# EAGLE design pcm5102_dac (EAGLE 9.6.2)
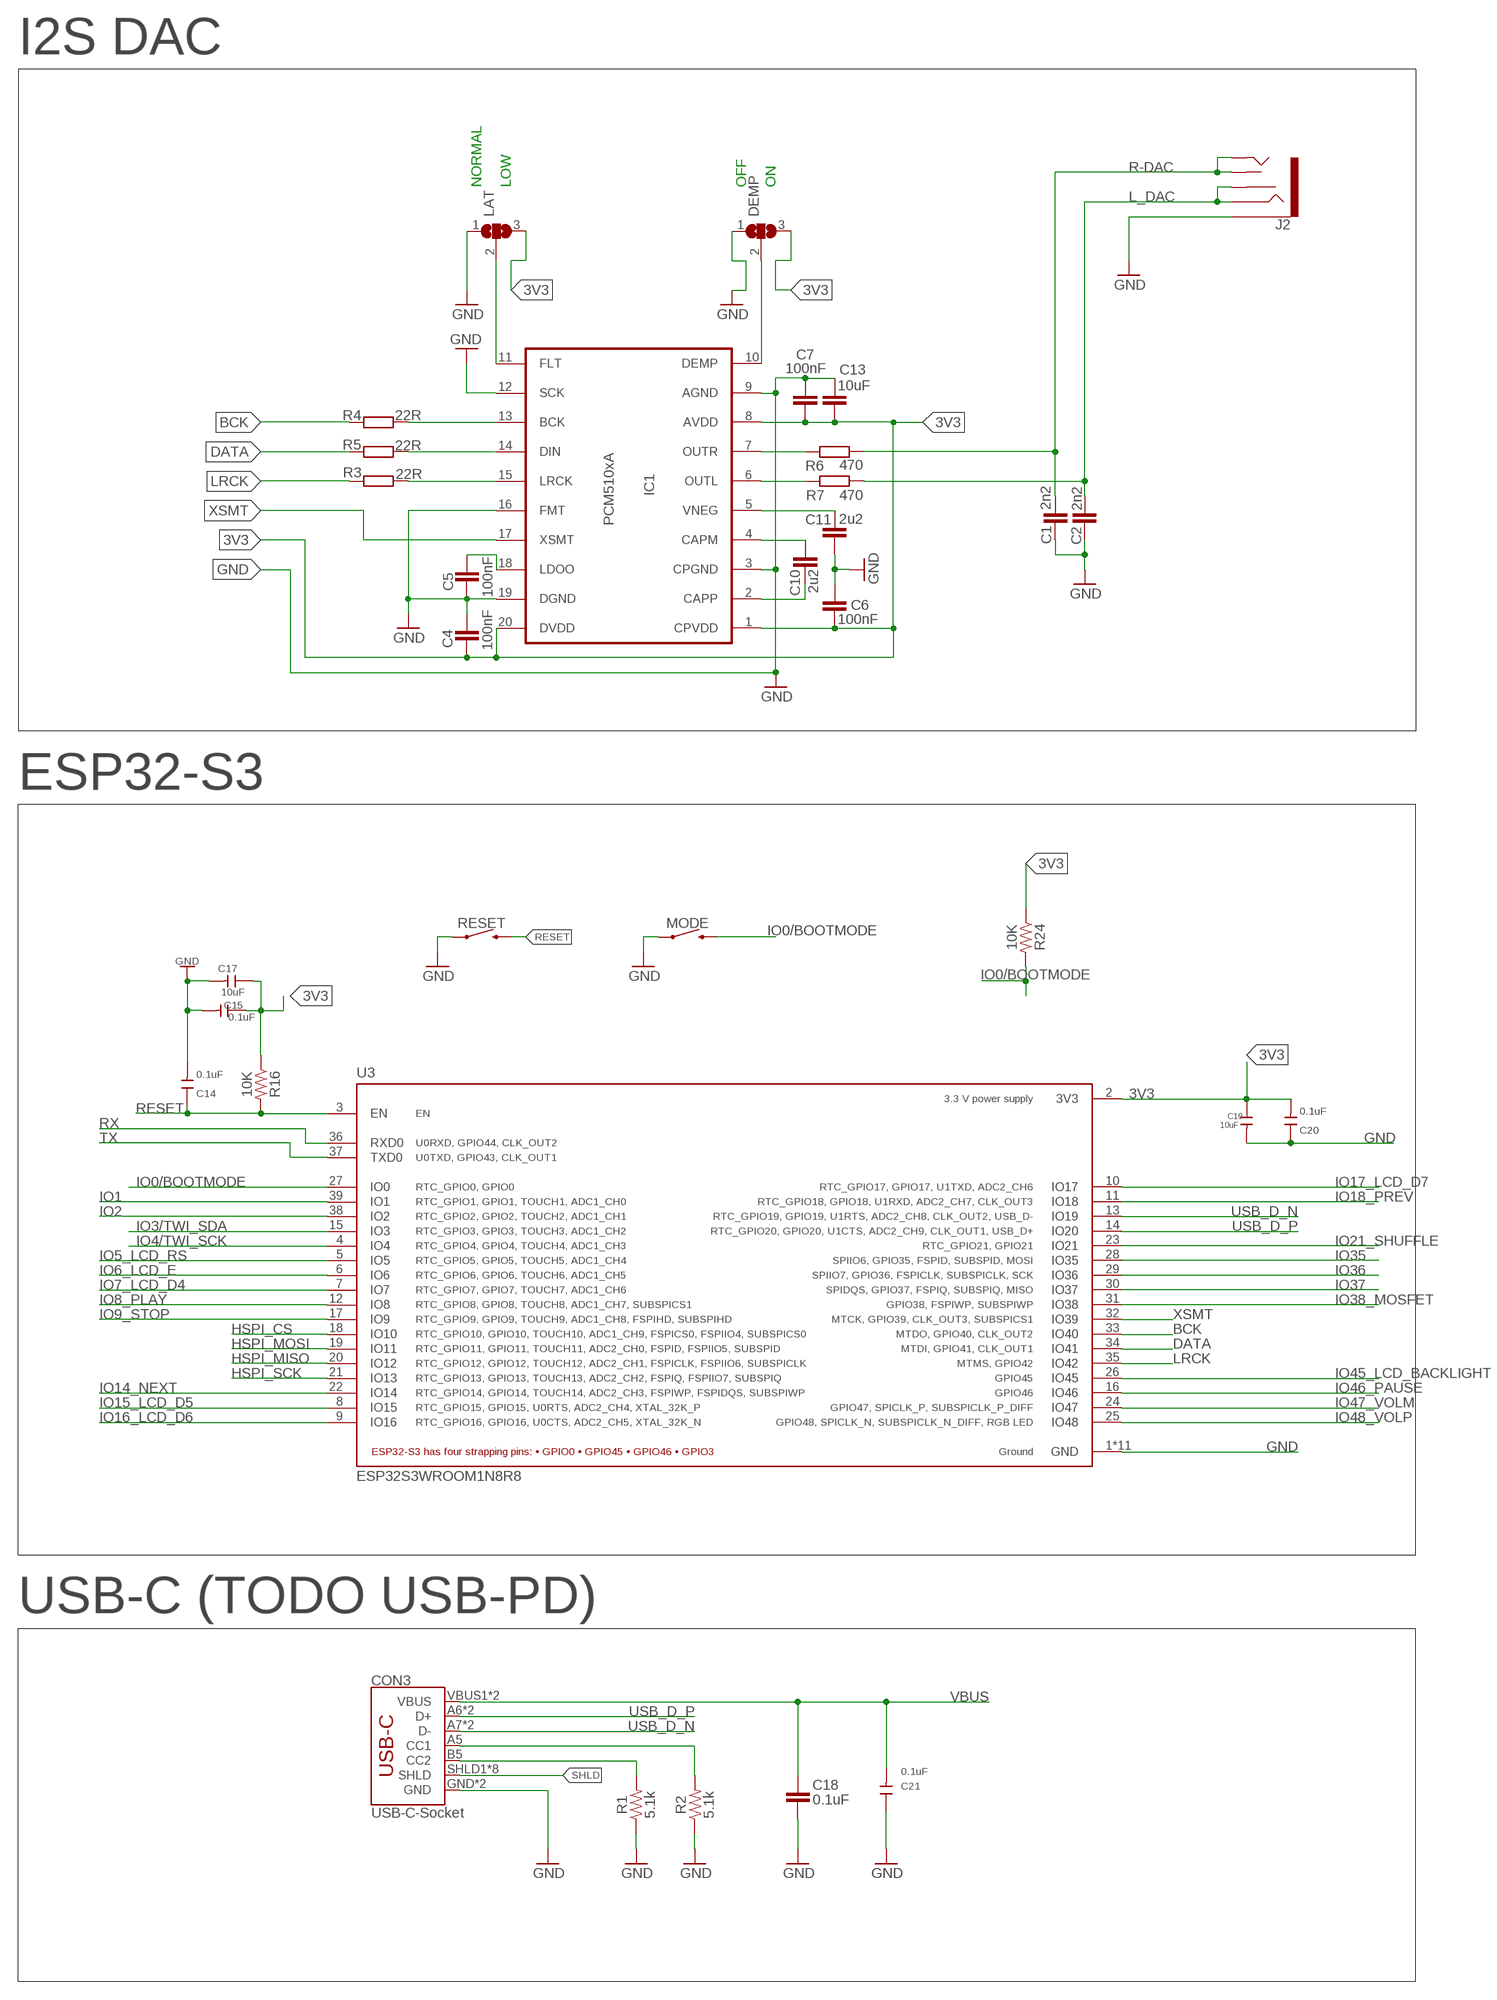
[diagram p0: schematic, sheet 1, part 1 of 3]
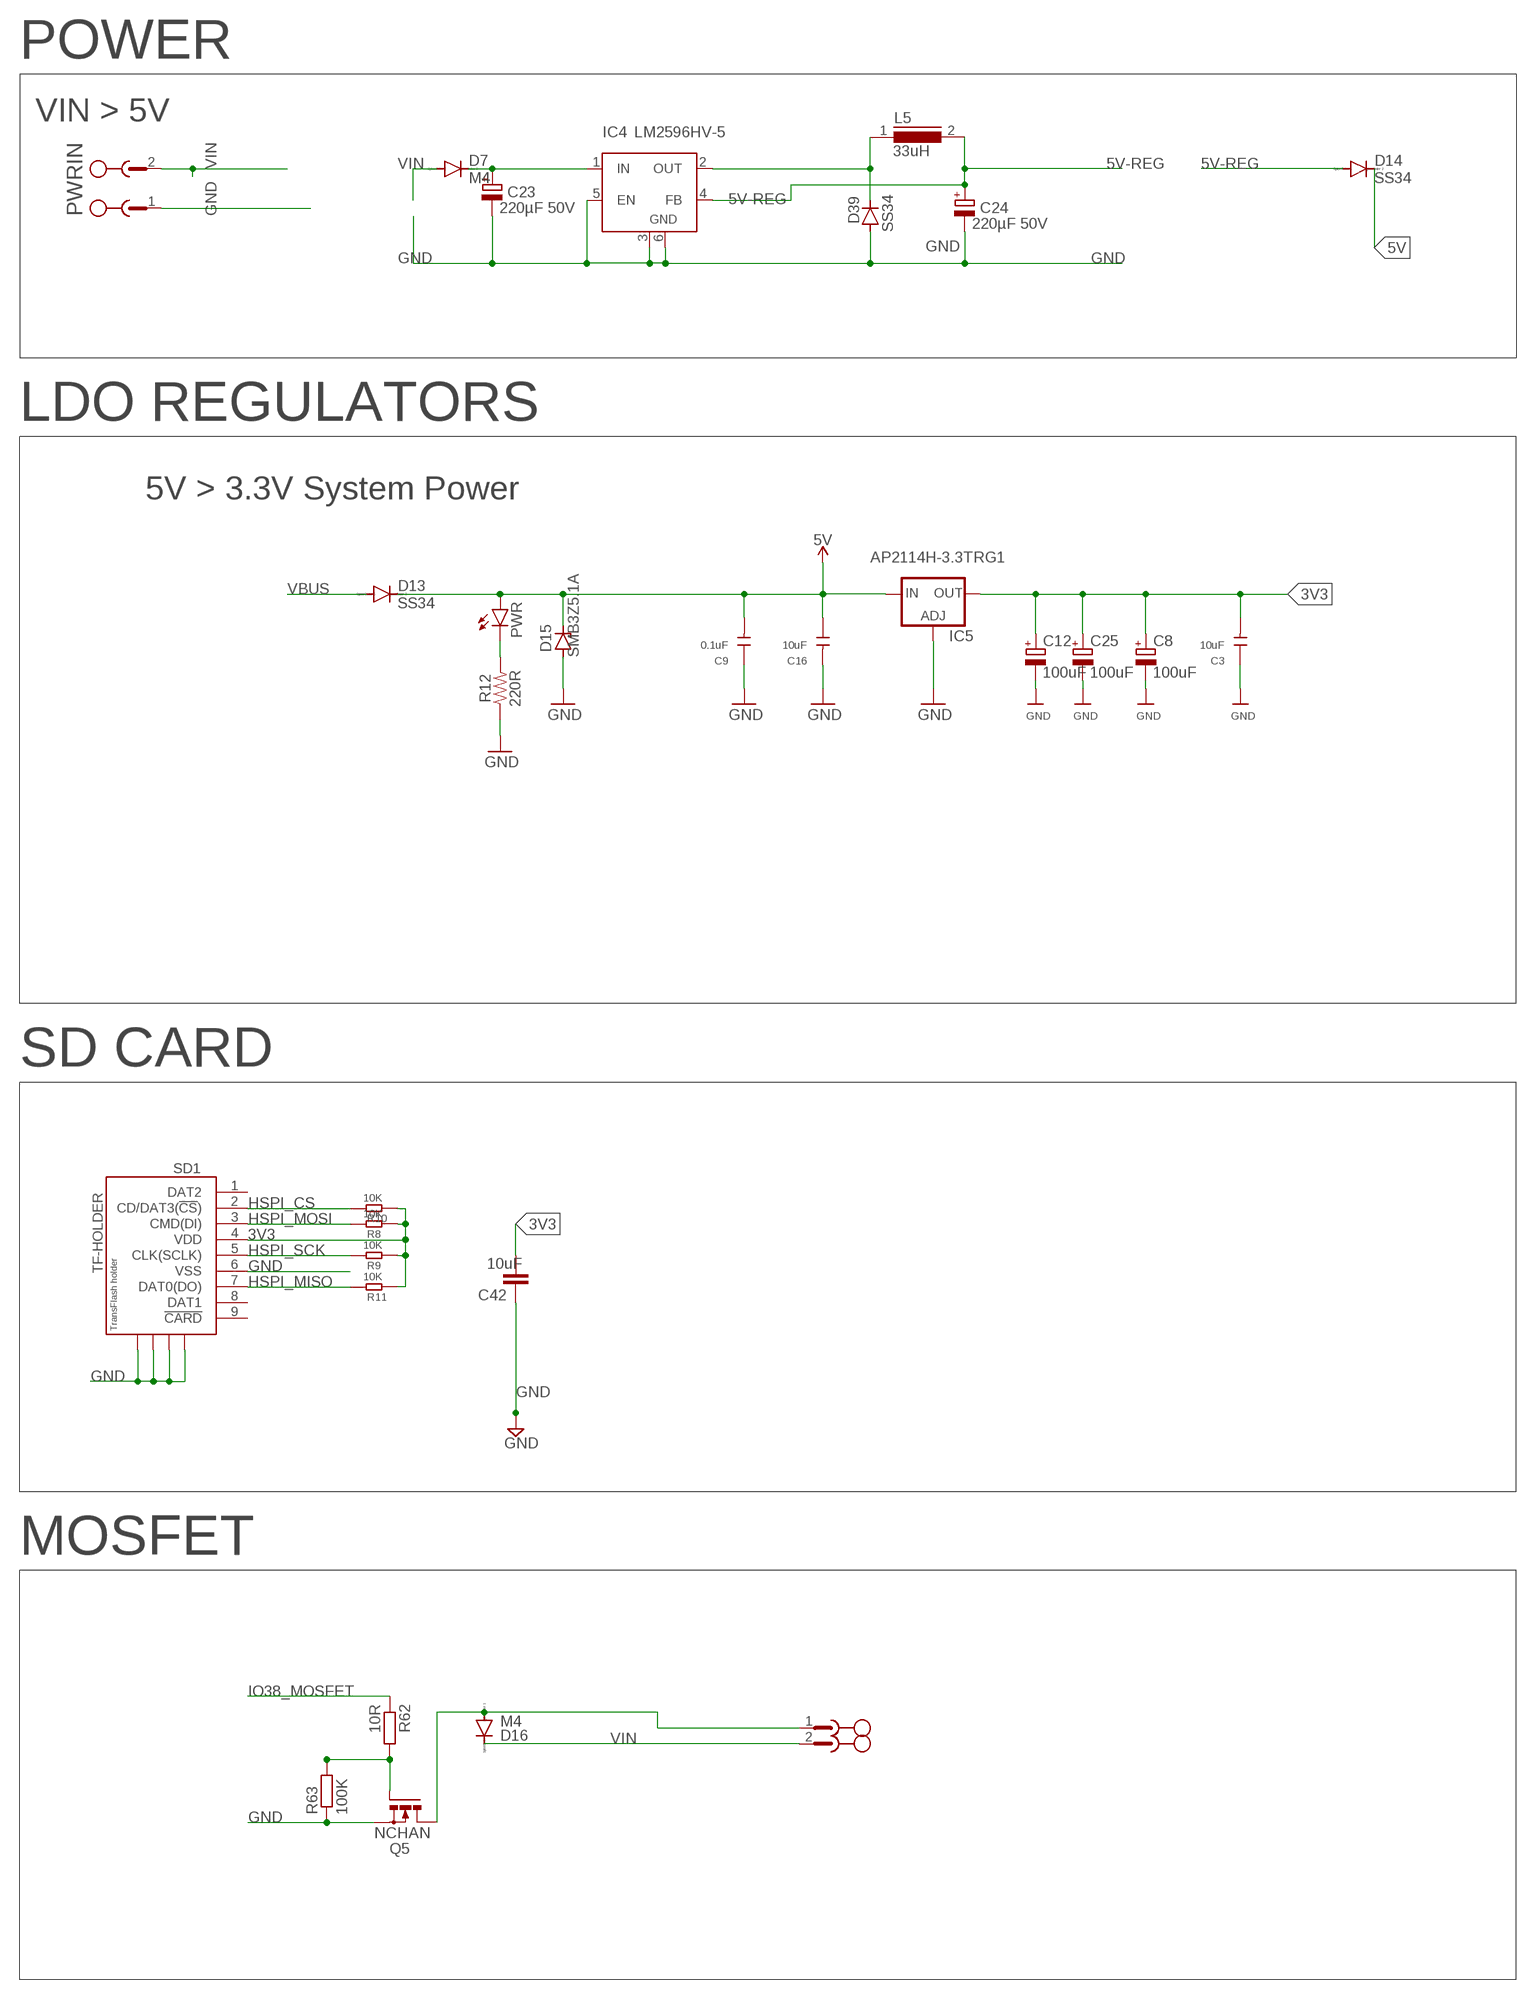
[diagram p1: schematic, sheet 1, part 2 of 3]
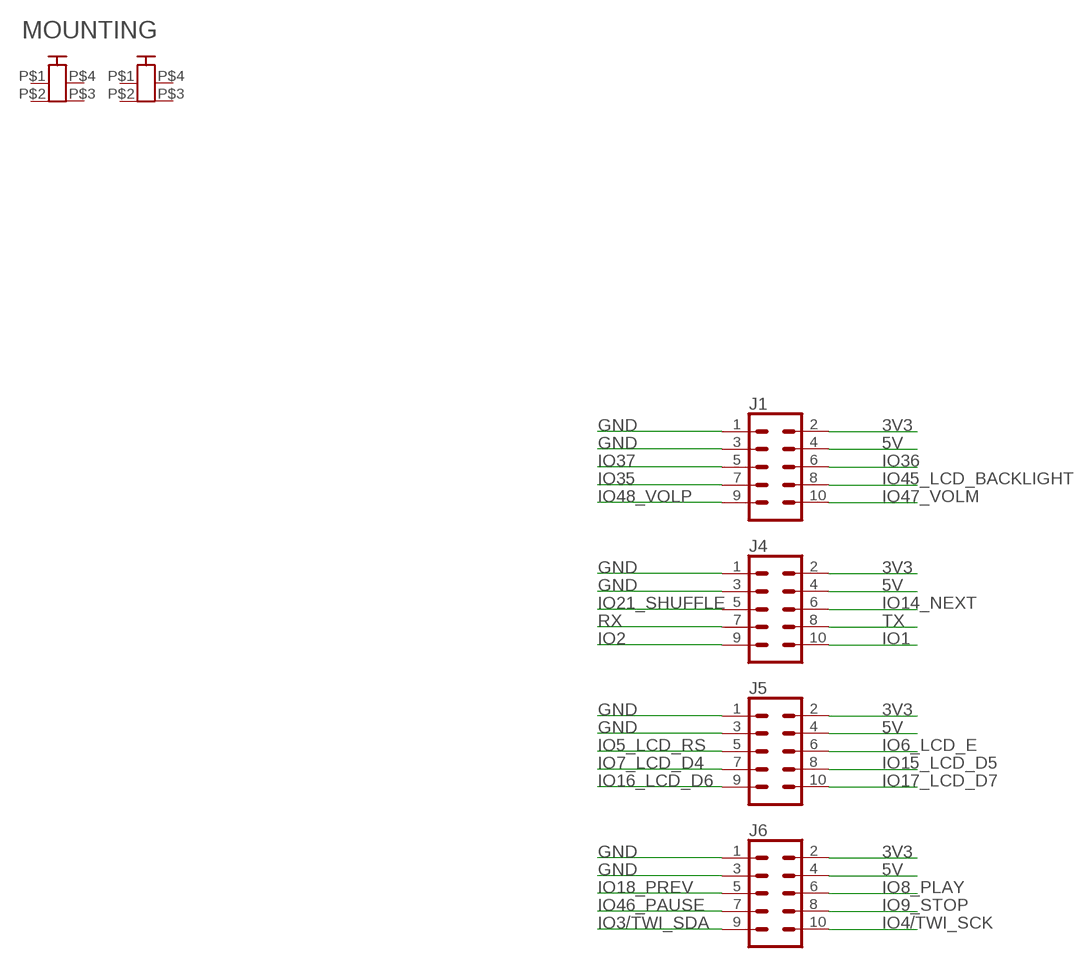
[diagram p2: schematic, sheet 1, part 3 of 3]

## Parts
C1  2n2  C-EUC1206  [C1206]
C2  2n2  C-EUC1206  [C1206]
C3  10uF  DISCRETE_C-1206  [DISCRETE_C1206]
C4  100nF  C-EUC1206  [C1206]
C5  100nF  C-EUC1206  [C1206]
C6  100nF  C-EUC1206  [C1206]
C7  100nF  C-EUC1206  [C1206]
C8  100uF  CPOL-EUD  [PANASONIC_D]
C9  0.1uF  DISCRETE_C-0603  [DISCRETE_C0603]
C10  2u2  C-EUC1206  [C1206]
C11  2u2  C-EUC1206  [C1206]
C12  100uF  CPOL-EUD  [PANASONIC_D]
C13  10uF  C-EUC1206  [C1206]
C14  0.1uF  DISCRETE_C-0603  [DISCRETE_C0603]
C15  0.1uF  DISCRETE_C-0603  [DISCRETE_C0603]
C16  10uF  C-1206  [C1206]
C17  10uF  DISCRETE_C-1206  [DISCRETE_C1206]
C18  0.1uF  CAP0603-CAP  [0603-CAP]
C19  10uF  C-1206  [C1206]
C20  0.1uF  DISCRETE_C-0603  [DISCRETE_C0603]
C21  0.1uF  DISCRETE_C-0603  [DISCRETE_C0603]
C23  220µF 50V  CPOL-EUE  [PANASONIC_E]
C24  220µF 50V  CPOL-EUE  [PANASONIC_E]
C25  100uF  CPOL-EUD  [PANASONIC_D]
C42  10uF  C-EUC1206  [C1206]
CON3  USB-C-Socket  USB_C16PIN  [USB-C-16P]
CON7  PCB-2M3  [PCB2-M3]
CON8  PCB-2M3  [PCB2-M3]
D7  M4  DIODE-DO-214AC  [DO-214AC]
D13  SS34  DIODE-DO-214AC  [DO-214AC]
D14  SS34  DIODE-DO-214AC  [DO-214AC]
D15  SMB3Z5.1A  ZENER-DIODESMB  [SMB]
D16  M4  DIODE-DO-214AC  [DO-214AC]
D39  SS34  D-SOD-87  [SOD87]
DEMP  SJ2W  [SJ_2]
IC1  PCM510xA  PCM510X  [TSSOP20]
IC4  LM2596HV-5  LM2596S  [TO263-5]
IC5  AP2114H-3.3TRG1  LD117AS33TR  [SOT223]
J1  CONN_05X2SHD  [2X5-SHROUDED]
J2  AUDIO_JACK_3.5MM_PTH  [AUDIO-JACK]
J4  CONN_05X2SHD  [2X5-SHROUDED]
J5  CONN_05X2SHD  [2X5-SHROUDED]
J6  CONN_05X2SHD  [2X5-SHROUDED]
L5  33uH  DR127  [DR127]
LAT  SJ2W  [SJ_2]
MODE  MOMENTARY-SWITCH-SPST-PTH-6.0MM  [TACTILE_SWITCH_PTH_6.0MM]
PWR  LED3MM  [LED3MM]
PWRIN  Phoenix Pluggable 5.08mm 2 way  MSTBA2  [MSTBA2]
Q5  NCHAN  N-POWER-MOSFETDPAK-MOSFET  [D-PAK_TO252AA]
R1  5.1k  5.1KOHM5.1KOHM-0603-1/10W-1%  [0603@1]
R2  5.1k  5.1KOHM5.1KOHM-0603-1/10W-1%  [0603@1]
R3  22R  R-EU_R0805  [R0805]
R4  22R  R-EU_R0805  [R0805]
R5  22R  R-EU_R0805  [R0805]
R6  470  R-EU_R1206  [R1206]
R7  470  R-EU_R1206  [R1206]
R8  10K  R-0603  [R0603]
R9  10K  R-0603  [R0603]
R10  10K  R-0603  [R0603]
R11  10K  R-0603  [R0603]
R12  220R  5.1KOHM5.1KOHM-0603-1/10W-1%  [0603@1]
R16  10K  5.1KOHM5.1KOHM-0603-1/10W-1%  [0603@1]
R24  10K  5.1KOHM5.1KOHM-0603-1/10W-1%  [0603@1]
R62  10R  R-EU_R0603  [R0603]
R63  100K  R-EU_R0603  [R0603]
RESET  MOMENTARY-SWITCH-SPST-PTH-6.0MM  [TACTILE_SWITCH_PTH_6.0MM]
SD1  TF-HOLDER  [TF-PULL]
SWOUT  Phoenix Pluggable 5.08mm 2 way  MSTBA2  [MSTBA2]
U3  ESP32S3WROOM1N8R8  [XCVR_ESP32S3WROOM1N8R8]

## Nets
3V3: C3.2 C4.2 C6.2 C7.2 C8.+ C12.+ C13.2 C15.1 C17.1 C19.1 C20.2 C25.+ C42.2 DEMP.3 IC1.1(CPVDD) IC1.8(AVDD) IC1.20(DVDD) IC5.4(OUT) J1.2 J4.2 J5.2 J6.2 LAT.3 R8.1 R9.1 R10.1 R11.1 R16.1 R24.1 SD1.4(VDD) U3.2(3V3)
5V: C9.2 C16.1 D13.C D14.C D15.C IC5.3(IN) J1.4 J4.4 J5.4 J6.4 PWR.A
5V-REG: C24.+ D14.A IC4.4(FB) L5.2
+24V: C23.+ D7.C IC4.1(IN)
BCK: R4.1 U3.33(IO40)
CC1: CON3.A5(CC1) R2.2
CC2: CON3.B5(CC2) R1.2
DATA: R5.1 U3.34(IO41)
GND: C1.2 C2.2 C3.1 C4.1 C5.2 C6.1 C7.1 C8.- C9.1 C11.2 C12.- C13.1 C14.2 C15.2 C16.2 C17.2 C18.2 C19.2 C20.1 C21.1 C23.- C24.- C25.- C42.1 CON3.GND CON3.GND2(GND) D15.A D39.2(A) DEMP.1 IC1.3(CPGND) IC1.9(AGND) IC1.12(SCK) IC1.16(FMT) IC1.19(DGND) IC4.3(GND) IC4.5(EN) IC4.6(GND) IC5.1(ADJ) J1.1 J1.3 J2.SLEEVE J4.1 J4.3 J5.1 J5.3 J6.1 J6.3 LAT.1 MODE.1 PWRIN.1 Q5.3(S) R1.1 R2.1 R12.1 R63.1 RESET.1 SD1.6(VSS) SD1.S1 SD1.S2 SD1.S3 SD1.S4 U3.1(GND) U3.40(GND) U3.41_1(GND) U3.41_2(GND) U3.41_3(GND) U3.41_4(GND) U3.41_5(GND) U3.41_6(GND) U3.41_7(GND) U3.41_8(GND) U3.41_9(GND)
HSPI_CS: R10.2 SD1.2(CD/DAT3(!CS!)) U3.18(IO10)
HSPI_MISO: R11.2 SD1.7(DAT0(DO)) U3.20(IO12)
HSPI_MOSI: R8.2 SD1.3(CMD(DI)) U3.19(IO11)
HSPI_SCK: R9.2 SD1.5(CLK(SCLK)) U3.21(IO13)
IO0/BOOTMODE: MODE.3 R24.2 U3.27(IO0)
IO1: J4.10 U3.39(IO1)
IO2: J4.9 U3.38(IO2)
IO3/TWI_SDA: J6.9 U3.15(IO3)
IO4/TWI_SCK: J6.10 U3.4(IO4)
IO5_LCD_RS: J5.5 U3.5(IO5)
IO6_LCD_E: J5.6 U3.6(IO6)
IO7_LCD_D4: J5.7 U3.7(IO7)
IO8_PLAY: J6.6 U3.12(IO8)
IO9_STOP: J6.8 U3.17(IO9)
IO14_NEXT: J4.6 U3.22(IO14)
IO15_LCD_D5: J5.8 U3.8(IO15)
IO16_LCD_D6: J5.9 U3.9(IO16)
IO17_LCD_D7: J5.10 U3.10(IO17)
IO18_PREV: J6.5 U3.11(IO18)
IO21_SHUFFLE: J4.5 U3.23(IO21)
IO35: J1.7 U3.28(IO35)
IO36: J1.6 U3.29(IO36)
IO37: J1.5 U3.30(IO37)
IO38_MOSFET: R62.1 U3.31(IO38)
IO45_LCD_BACKLIGHT: J1.8 U3.26(IO45)
IO46_PAUSE: J6.7 U3.16(IO46)
IO47_VOLM: J1.10 U3.24(IO47)
IO48_VOLP: J1.9 U3.25(IO48)
L_DAC: C2.1 J2.RING J2.RSH R7.2
LDOO: C5.1 IC1.18(LDOO)
LRCK: R3.1 U3.35(IO42)
MOSFET-GND: D16.A Q5.4(D) SWOUT.1
N$1: PWR.K(C) R12.2
N$3: Q5.1(G) R62.2 R63.2
N$10: IC1.13(BCK) R4.2
N$11: IC1.14(DIN) R5.2
N$12: IC1.11(FLT) LAT.2
N$13: DEMP.2 IC1.10(DEMP)
N$34: IC1.15(LRCK) R3.2
N$43: C10.1 IC1.4(CAPM)
N$46: C10.2 IC1.2(CAPP)
N$47: C11.1 IC1.5(VNEG)
N$48: IC1.7(OUTR) R6.1
N$49: IC1.6(OUTL) R7.1
N$164: D39.1(C) IC4.2(OUT) L5.1
R-DAC: C1.1 J2.TIP J2.TSH R6.2
RESET: C14.1 R16.2 RESET.3 U3.3(EN)
RX: J4.7 U3.36(RXD0)
SHLD: CON3.SHLD1(SHLD) CON3.SHLD2(SHLD) CON3.SHLD3(SHLD) CON3.SHLD4(SHLD) CON3.SHLD5(SHLD) CON3.SHLD6(SHLD) CON3.SHLD7(SHLD) CON3.SHLD8(SHLD)
TX: J4.8 U3.37(TXD0)
USB_D_N: CON3.A7(D-) CON3.B7(D-) U3.13(IO19)
USB_D_P: CON3.A6(D+) CON3.B6(D+) U3.14(IO20)
VBUS: C18.1 C21.2 CON3.VBUS1(VBUS) CON3.VBUS2(VBUS) D13.A
VIN: D7.A D16.C PWRIN.2 SWOUT.2
XSMT: IC1.17(XSMT) U3.32(IO39)
Unconnected: CON7.P$1 CON7.P$2 CON7.P$3 CON7.P$4 CON8.P$1 CON8.P$2 CON8.P$3 CON8.P$4 SD1.1(DAT2) SD1.8(DAT1) SD1.9(!CARD)

## Notes on the sheet
- I2S DAC
- NORMAL | LOW | OFF | ON
- ESP32-S3
- USB-C (TODO USB-PD)
- MOUNTING
- POWER
- VIN > 5V
- PWRIN
- LDO REGULATORS
- 5V > 3.3V System Power
- SD CARD
- MOSFET

## Library data of the parts
C1 C2 C4-C7 C10 C11 C13 = rcl:C-EU: CAPACITOR, European symbol
C3 C9 C14 C15 C17 C20 C21 = A9G:DISCRETE_C*: Ceramic Capacitors
C8 C12 C25 = rcl:CPOL-EU: POLARIZED CAPACITOR, European symbol; SPICEPREFIX: C
C16 C19 = discrete:C*: Ceramic Capacitors
C18 = SparkFun:CAP: Capacitor Standard 0603 ceramic capacitor, and 0.1" leaded capacitor.
C23 C24 = resistor:CPOL-EU: POLARIZED CAPACITOR, European symbol
C42 = resistor:C-EU: CAPACITOR, European symbol
CON3 = SparkFun-Connectors:USB_C: USB Type C 16Pin Connector Super Speed pins not available on the 16-pin purely SMD connector so this part is best for USB 2.0 implementations. D1 and D2 are tied together enabling D+/- no matter which way the cable is plugged into the connector. The two channel configuration pins (CC1/2) are exposed. These are normally connected to ground via 5.1k resistors but can be reconfigured for high current/high power applications.; PROD_ID: CONN-14122
CON7 CON8 = Screw Terminals:PCB-2M3
D7 D13 D14 D16 = diode:DIODE-: DIODE
D15 = diode:ZENER-DIODE: Z-Diode
D39 = semicon-smd-ipc:D-: DIODE unfilled
DEMP LAT = jumper:SJ2W: SMD solder JUMPER
IC1 = pavouk:PCM510X: 2VRMS DirectPath™, 112/106/100dB Audio Stereo DAC with 32-bit, 384kHz PCM Interface
IC4 = linear:LM2596S: STEP-DOWN VOLTAGE REGULATOR
IC5 = v-reg:LD117A?*: Low drop fixed and adjustable positive voltage regulators 1 A Source: http://www.st.com/stonline/products/literature/ds/7194/ld1117axx.pdf
J1 J4-J6 = SparkFun-Connectors:CONN_05X2: Multi connection point. Often used as Generic Header-pin footprint for 0.1 inch spaced/style header connections For AVR SPI programming port, see special device with nice symbol: "AVR_SPI_PROG_5x2.dev" You can populate with any combo of single row headers, but if you'd like an exact match, check these: 2x5 AVR ICSP Male Header <https://www.sparkfun.com/products/778> (PRT-00778) 2x5 Pin Shrouded Header <https://www.sparkfun.com/products/8506> (PRT-08506) On any of the 0.1 inch spaced packages, you can populate with these: Break Away Headers - Straight <https://www.sparkfun.com/products/116> (PRT-00116) Break Away Male Headers - Right Angle <https://www.sparkfun.com/products/553> (PRT-00553) Female Headers <https://www.sparkfun.com/products/115> (PRT-00115) Break Away Headers - Machine Pin <https://www.sparkfun.com/products/117> (PRT-00117) Break Away Female Headers - Swiss Machine Pin <https://www.sparkfun.com/products/743> (PRT-00743) Special note: the shrouded connector mates well with our 5x2 ribbon cables: 2x5 Pin IDC Ribbon Cable <https://www.sparkfun.com/products/8535> (PRT-08535); PROD_ID: CONN-08671; SF_ID: PRT-08506
J2 = SparkFun-Connectors2:AUDIO_JACK_3.5MM: Audio Jack 3.5mm variants of PTH and SMT stereo audio jack with bypass switches. SparkFun Products: SparkFun SparkPunk Sound Kit <[https://www.sparkfun.com/products/11177]> - PTH MP3 Trigger <https://www.sparkfun.com/products/13720> -3.5mm SMD SparkFun PicoBoard <https://www.sparkfun.com/products/11888>- 2.5mm SMD; PROD_ID: CONN-08774; SF_ID: PRT-08032
L5 = inductors:DR127: High Power Density, High Efficiency, Shielded Inductors Source: coiltronics_dr_series.pdf; SPICEPREFIX: L
MODE RESET = SparkFun-Switches:MOMENTARY-SWITCH-SPST: Momentary Switch (Pushbutton) - SPST Normally-open (NO) SPST momentary switches (buttons, pushbuttons). Variants PTH-12MM - 12mm square, through-hole Momentary Pushbutton Switch - 12mm Square <https://www.sparkfun.com/products/9190> (COM-09190) PTH-6.0MM, PTH-6.0MM-KIT - 6.0mm square, through-hole Mini Pushbutton Switch <https://www.sparkfun.com/products/97> (COM-00097) KIT package intended for soldering kit's - only one side of pads' copper is exposed. PTH-RIGHT-ANGLE-KIT - Right-angle, through-hole Right Angle Tactile Button <https://www.sparkfun.com/products/10791> - Used on SparkFun BigTime Watch Kit <https://www.sparkfun.com/products/11734> SMD-12MM - 12mm square, surface-mount Tactile Button - SMD (12mm) <https://www.sparkfun.com/products/12993> (COM-12993) Used on SparkFun PicoBoard <https://www.sparkfun.com/products/11888> SMD-4.5MM - 4.5mm Square Trackball Switch Used on SparkFun Blackberry Trackballer Breakout <https://www.sparkfun.com/products/13169> SMD-4.6MMX2.8MM - 4.60mm x 2.80mm, surface mount Used on SparkFun SAMD21 Mini Breakout <https://www.sparkfun.com/products/13664> SMD-5.2MM, SMD-5.2-REDUNDANT - 5.2mm square, surface-mount Mini Pushbutton Switch - SMD <https://www.sparkfun.com/products/8720> (COM-08720) Used on Arduino Pro Mini <https://www.sparkfun.com/products/11114> REDUNDANT package connects both switch circuits together SMD-6.0X3.5MM - 6.0 x 3.5mm, surface mount Momentary Reset Switch SMD <https://www.sparkfun.com/products/8229> (COM-08229) SMD-6.2MM-TALL - 6.2mm square, surface mount Tactile Button - SMD (6mm) <https://www.sparkfun.com/products/12992> Used on SparkFun Digital Sandbox <https://www.sparkfun.com/products/12651> SMD-RIGHT-ANGLE - Right-angle, surface mount Used on SparkFun Block for Intel® Edison - Arduino <https://www.sparkfun.com/products/13036>; PROD_ID: SWCH-08441; SF_SKU: COM-00097
PWR = led:LED: LED OSRAM: - CHIPLED LG R971, LG N971, LY N971, LG Q971, LY Q971, LO R971, LY R971 LH N974, LH R974 LS Q976, LO Q976, LY Q976 LO Q996 - Hyper CHIPLED LW Q18S LB Q993, LB Q99A, LB R99A - SideLED LS A670, LO A670, LY A670, LG A670, LP A670 LB A673, LV A673, LT A673, LW A673 LH A674 LY A675 LS A676, LA A676, LO A676, LY A676, LW A676 LS A679, LY A679, LG A679 - Hyper Micro SIDELED® LS Y876, LA Y876, LO Y876, LY Y876 LT Y87S - SmartLED LW L88C, LW L88S LB L89C, LB L89S, LG L890 LS L89K, LO L89K, LY L89K LS L896, LA L896, LO L896, LY L896 - TOPLED LS T670, LO T670, LY T670, LG T670, LP T670 LSG T670, LSP T670, LSY T670, LOP T670, LYG T670 LG T671, LOG T671, LSG T671 LB T673, LV T673, LT T673, LW T673 LH T674 LS T676, LA T676, LO T676, LY T676, LB T676, LH T676, LSB T676, LW T676 LB T67C, LV T67C, LT T67C, LS T67K, LO T67K, LY T67K, LW E67C LS E67B, LA E67B, LO E67B, LY E67B, LB E67C, LV E67C, LT E67C LW T67C LS T679, LY T679, LG T679 LS T770, LO T770, LY T770, LG T770, LP T770 LB T773, LV T773, LT T773, LW T773 LH T774 LS E675, LA E675, LY E675, LS T675 LS T776, LA T776, LO T776, LY T776, LB T776 LHGB T686 LT T68C, LB T68C - Hyper Mini TOPLED® LB M676 - Mini TOPLED Santana® LG M470 LS M47K, LO M47K, LY M47K Source: http://www.osram.convergy.de LUXEON: - LUMILED® LXK2-PW12-R00, LXK2-PW12-S00, LXK2-PW14-U00, LXK2-PW14-V00 LXK2-PM12-R00, LXK2-PM12-S00, LXK2-PM14-U00 LXK2-PE12-Q00, LXK2-PE12-R00, LXK2-PE12-S00, LXK2-PE14-T00, LXK2-PE14-U00 LXK2-PB12-K00, LXK2-PB12-L00, LXK2-PB12-M00, LXK2-PB14-N00, LXK2-PB14-P00, LXK2-PB14-Q00 LXK2-PR12-L00, LXK2-PR12-M00, LXK2-PR14-Q00, LXK2-PR14-R00 LXK2-PD12-Q00, LXK2-PD12-R00, LXK2-PD12-S00 LXK2-PH12-R00, LXK2-PH12-S00 LXK2-PL12-P00, LXK2-PL12-Q00, LXK2-PL12-R00 Source: www.luxeon.com KINGBRIGHT: KA-3528ASYC Source: www.kingbright.com
PWRIN SWOUT = con-phoenix-508:MSTBA2: PHOENIX; MF: FARNELL; MPN: 1757242; OC_FARNELL: 3705171; OC_NEWARK: 71C4161
Q5 = Cohesion_parts:N-POWER-MOSFET
R1 R2 = SparkFun-Resistors:5.1KOHM; PROD_ID: RES-12083
R3-R7 = rcl:R-EU_: RESISTOR, European symbol
R8-R11 = discrete:R*
R12 R16 R24 = SparkFun-Resistors:5.1KOHM; PROD_ID: RES-12083; VALUE: 5.1k
R62 R63 = resistor:R-EU_: RESISTOR, European symbol
SD1 = sd-mmc:TF-HOLDER: TF / Micro SD socket is PUSH-PUSH type, the card can be pushed into and auto locked and pushed out by simply press the card. Surface Mounting type.
U3 = ESP32S3WROOM1N8R8:ESP32S3WROOM1N8R8: Check availability <https://pricing.snapeda.com/parts/ESP32S3WROOM1N8R8/Espressif%20Systems/view-part?ref=eda>; AVAILABILITY: In Stock; DESCRIPTION: Bluetooth, WiFi 802.11b/g/n, Bluetooth v5.0 Transceiver Module 2.4GHz PCB Trace Surface Mount; MF: Espressif Systems; MP: ESP32S3WROOM1N8R8; PACKAGE: None; PRICE: None; PURCHASE-URL: https://pricing.snapeda.com/search/part/ESP32S3WROOM1N8R8/?ref=eda

## Net classes
0 default: width 0.254 mm, clearance 0.152 mm

## Board
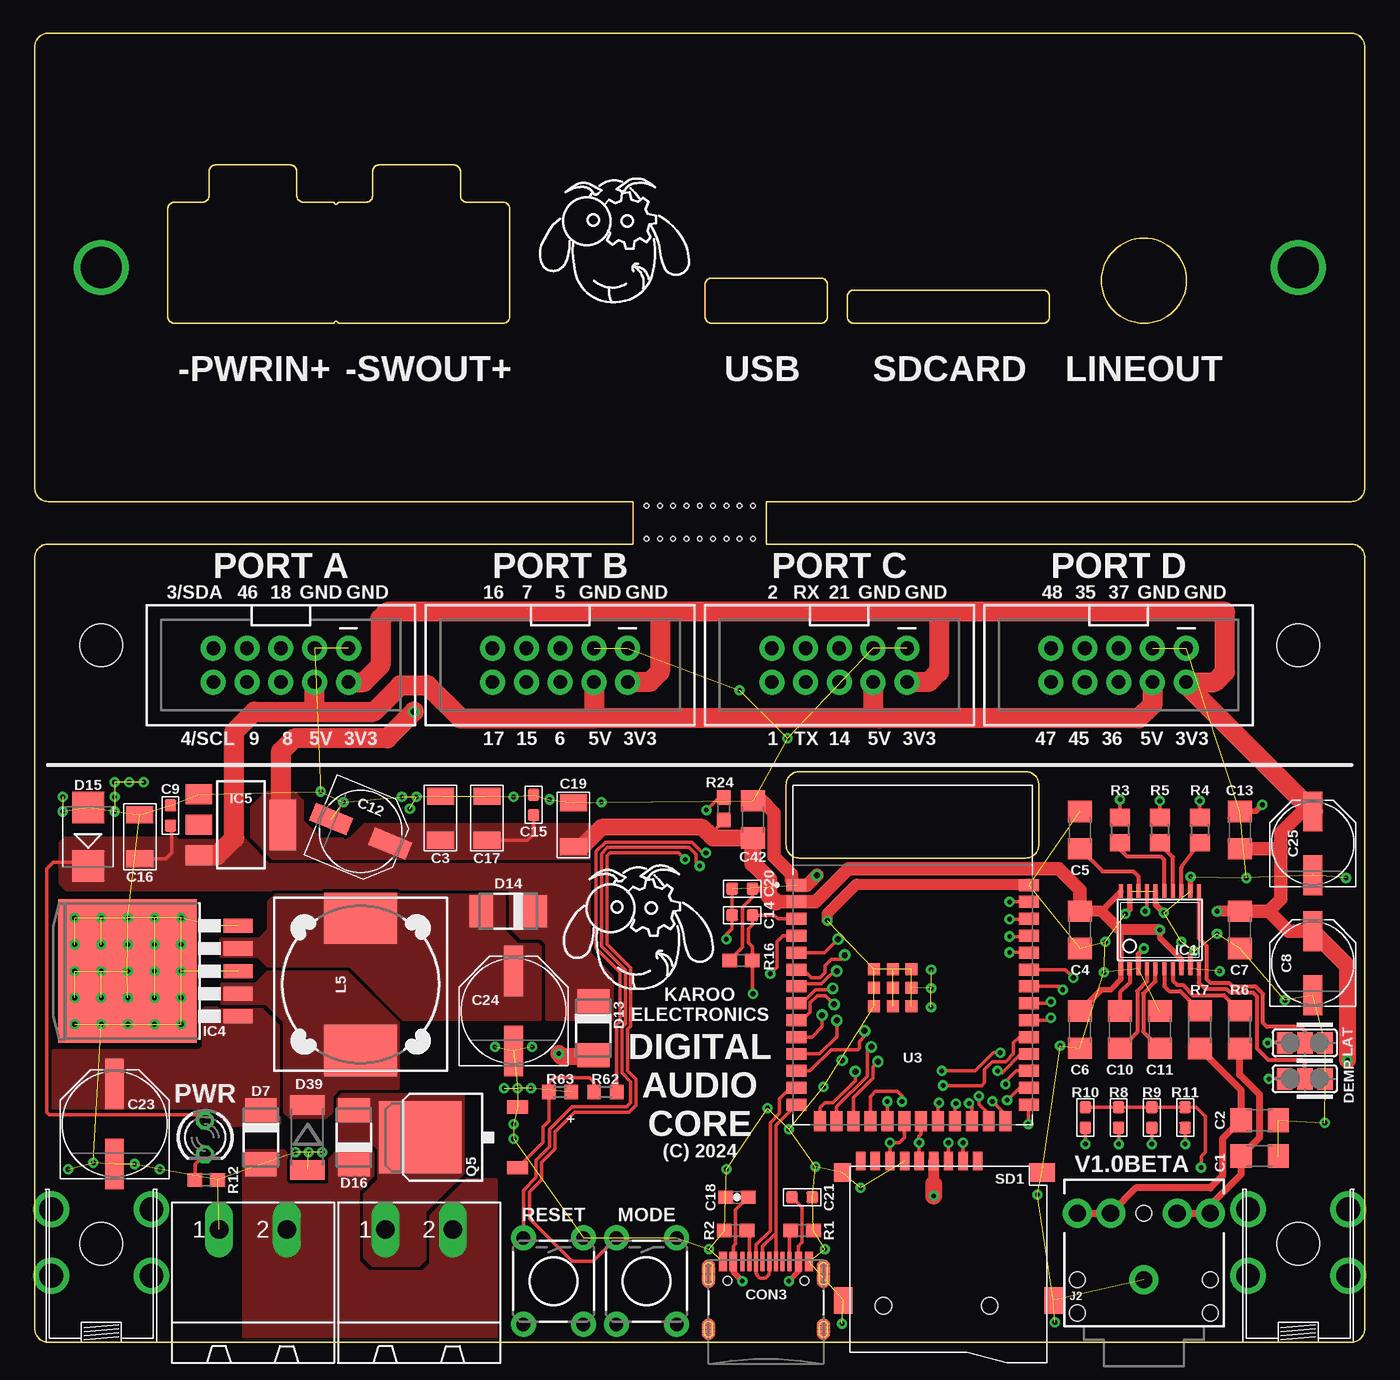
[diagram p3: board, top side]
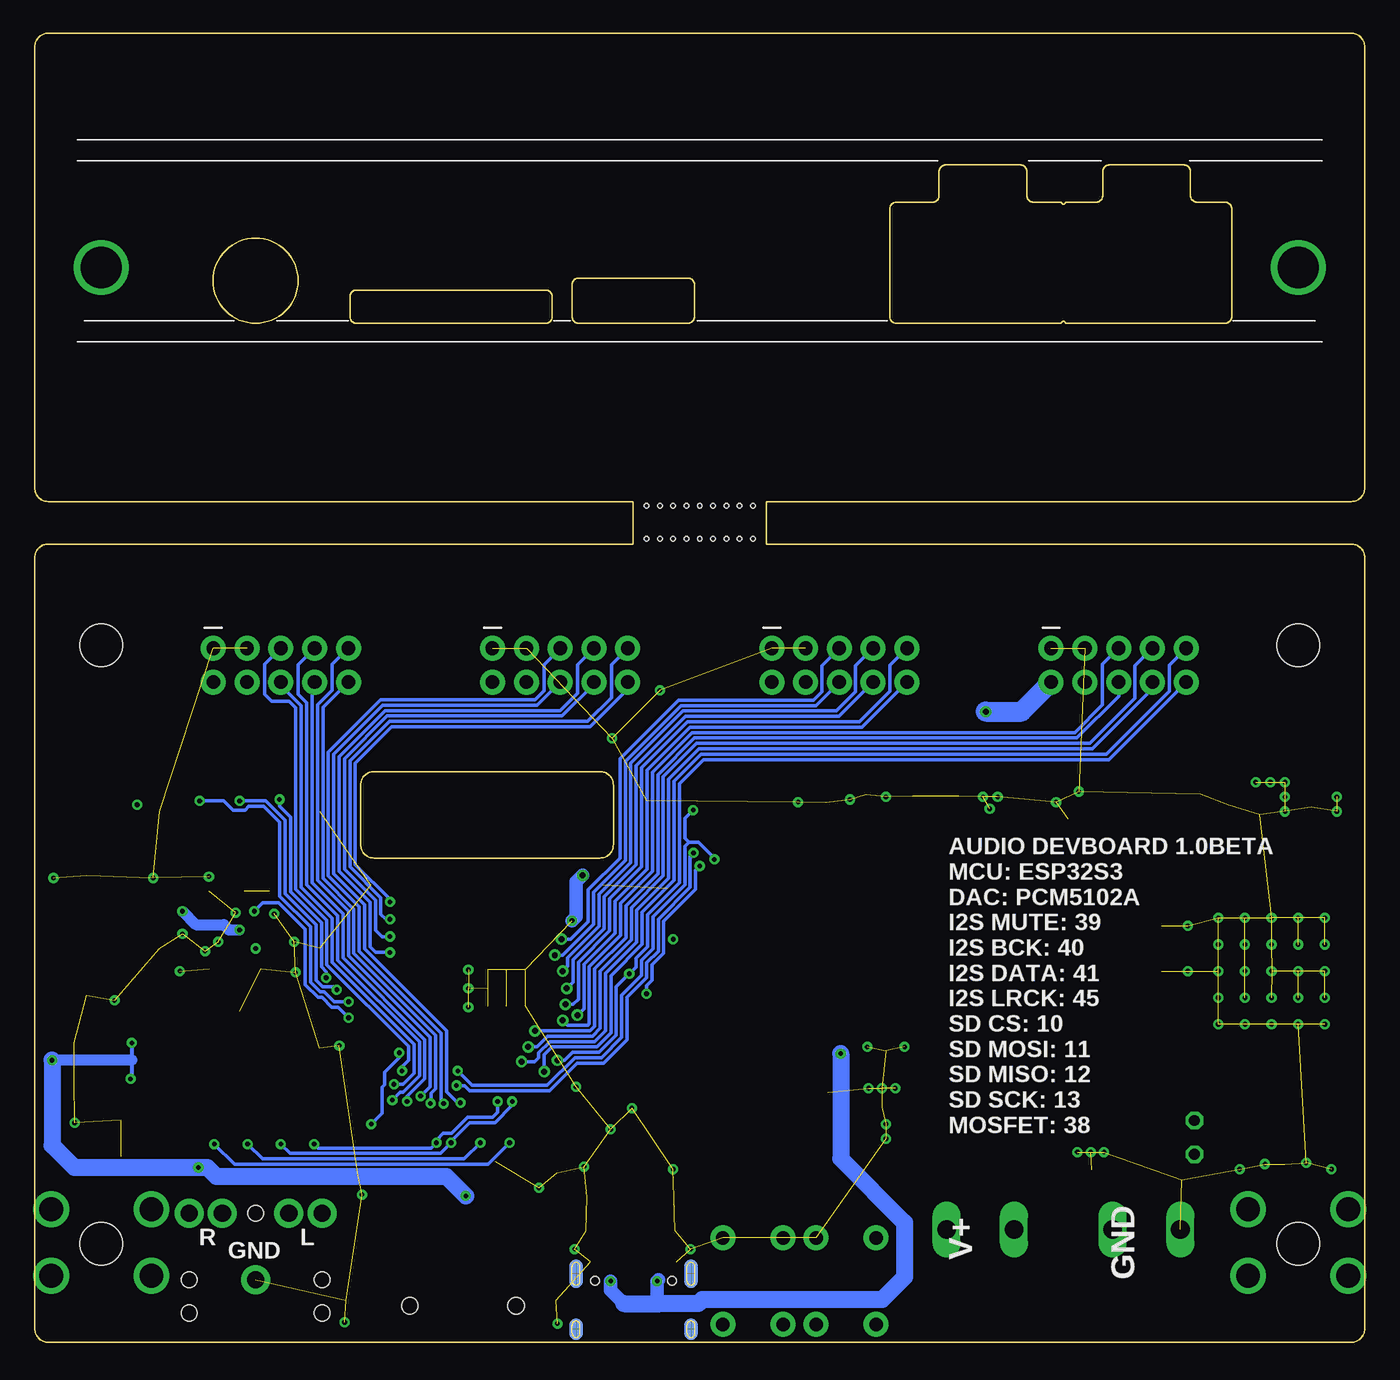
[diagram p4: board, bottom side, seen from below]

Size 100 x 98.4 mm. Coordinates in mm from the lower left corner, seen from the top.
Outline: 99,0 1,0 arc-90 0,1 0,59 arc-90 1,60 45,60 45,63.2 1,63.2 arc-90 0,64.2 0,97.4 arc-90 1,98.4 99,98.4 arc-90 100,97.4 100,64.2 arc-90 99,63.2 55,63.2 55,60 99,60 arc-90 100,59 100,1 arc-90 99,0
Outline: 56.5,41.9 56.5,37.4 arc90 57.5,36.4 74.5,36.4 arc90 75.5,37.4 75.5,41.9 arc90 74.5,42.9 57.5,42.9 arc90 56.5,41.9
Outline: 22.5,76.6 10.5,76.6 arc-90 10,77.1 10,85.2 arc-90 10.5,85.7 12.6,85.7 arc90 13.1,86.2 13.1,88 arc-90 13.6,88.5 19.2,88.5 arc-90 19.7,88 19.7,86.2 arc90 20.2,85.7 22.5,85.7 arc180 22.8,85.7 24.9,85.7 arc90 25.4,86.2 25.4,88 arc-90 25.9,88.5 31.5,88.5 arc-90 32,88 32,86.2 arc90 32.5,85.7 35.2,85.7 arc-90 35.7,85.2 35.7,77.1 arc-90 35.2,76.6 22.8,76.6 arc180 22.5,76.6
Outline: 50.9,76.6 59.1,76.6 arc90 59.6,77.1 59.6,79.5 arc90 59.1,80 50.9,80 arc90 50.4,79.5 50.4,77.1 arc90 50.9,76.6
Outline: 80.2,79.8 arc180 86.6,79.8 arc180 80.2,79.8
Outline: 61.1,78.6 61.1,77.1 arc90 61.6,76.6 75.8,76.6 arc90 76.3,77.1 76.3,78.6 arc90 75.8,79.1 61.6,79.1 arc90 61.1,78.6
Copper layers (1*16): Top 0.035mm / dielectric 1.5mm / Bottom 0.035mm
Design rules "default *": minimum track width 6mil, minimum drill 0.35mm, track to track 6mil, track to pad 6mil, pad to pad 6mil, via to via 6mil, smd to smd 6mil, copper to edge 6mil, drill to drill 6mil, minimum pad ring 10mil, minimum via ring 8mil, stop-mask expansion 4mil, vias tented up to drill 0mil, thermal gap 10mil
Holes 3.2 mm at 5,7.4 95,7.4 5,52.4 95,52.4
Holes 0.35 mm at 46,62.9 47,62.9 48,62.9 49,62.9 50,62.9 51,62.9 52,62.9 53,62.9 54,62.9 46,60.4 47,60.4 48,60.4 49,60.4 50,60.4 51,60.4 52,60.4 53,60.4 54,60.4
tKeepout: area 2,49.5 to 8,55.5; area 2,4.4 to 8,10.4; area 92,4.4 to 98,10.4; area 92,49.5 to 98,55.5
bKeepout: area 92,4.4 to 98,10.4; area 2,4.4 to 8,10.4; area 2,49.5 to 8,55.5; area 92,49.5 to 98,55.5

### Footprints (pad centres in the part's own frame; a part is rotated, then mirrored left to right if it is on the bottom)
C1206 = smd 1.6 x 1.8: 1 -1.4,0; 2 1.4,0
DISCRETE_C1206 = smd 1.27 x 2.032: 1 -1.651,0; 2 1.651,0
PANASONIC_D = smd 3 x 1.4: + 2.4,0; - -2.4,0
DISCRETE_C0603 = smd 0.889 x 0.889: 1 -0.762,0; 2 0.762,0
C1206' = smd 1.27 x 2.032: 1 -1.651,0; 2 1.651,0
0603-CAP = smd 1.1 x 1: 1 -0.85,0; 2 0.85,0
PANASONIC_E = smd 3.8 x 1.4: + 3,0; - -3,0
USB-C-16P = smd 0.3 x 1.45: A5 -1.25,0; A6 -0.25,0; A7 0.25,0; A8 1.25,0; B5 1.75,0; B6 0.75,0; B7 -0.75,0; B8 -1.75,0 | smd 0.6 x 1.45: GND -3.225,0; GND2 3.225,0 | smd 1 x 2.1: SHLD1 -4.32,-0.915; SHLD2 4.32,-0.915 | smd 1 x 2.1 bottom: SHLD3 -4.32,-0.915; SHLD4 4.32,-0.915 | smd 1 x 1.6: SHLD5 -4.32,-5.095; SHLD8 4.32,-5.095 | smd 1 x 1.6 bottom: SHLD6 -4.32,-5.095; SHLD7 4.32,-5.095 | smd 0.55 x 1.45: VBUS1 -2.45,0; VBUS2 2.45,0 | hole 0.65: -2.89,-1.445; 2.89,-1.445
PCB2-M3 = drill 1.8: P$1 -3.77,-5; P$2 3.77,-5; P$3 3.77,-10; P$4 -3.77,-10
DO-214AC = smd 1.8 x 2.4: A 2.025,0; C -2.025,0
SMB = smd 2.4 x 2.4: A 2.2,0; C -2.2,0
SOD87 = smd 1.45 x 2.6: 1 -2.445,0; 2 2.445,0
SJ_2 = smd 1.168 x 1.6: 1 -1.524,0; 2 0,0; 3 1.524,0
TSSOP20 = smd 0.305 x 0.991: 1 -2.925,-2.918; 2 -2.275,-2.918; 3 -1.625,-2.918; 4 -0.975,-2.918; 5 -0.325,-2.918; 6 0.325,-2.918; 7 0.975,-2.918; 8 1.625,-2.918; 9 2.275,-2.918; 10 2.925,-2.918; 11 2.925,2.918; 12 2.275,2.918; 13 1.625,2.918; 14 0.975,2.918; 15 0.325,2.918; 16 -0.325,2.918; 17 -0.975,2.918; 18 -1.625,2.918; 19 -2.275,2.918; 20 -2.925,2.918
TO263-5 = smd 1.067 x 2.159: 1 -3.404,-5.791; 2 -1.702,-5.791; 3 0,-5.791; 4 1.702,-5.791; 5 3.404,-5.791 | smd 10.8 x 10.41: 6 0,2.54
SOT223 = smd 1.5 x 2: 1 -2.3,-3.15; 2 0,-3.15; 3 2.3,-3.15 | smd 3.8 x 2: 4 0,3.15
2X5-SHROUDED = drill 1.016 pad 1.88: 1 -1.27,5.08; 2 1.27,5.08; 3 -1.27,2.54; 4 1.27,2.54; 5 -1.27,0; 6 1.27,0; 7 -1.27,-2.54; 8 1.27,-2.54; 9 -1.27,-5.08; 10 1.27,-5.08
AUDIO-JACK = drill 1.3 pad 2.184: RING 5,5; RSH 5,2.5; SLEEVE 0,0; TIP 5,-5; TSH 5,-2.5 | hole 1.2: 0,5; -2.5,5; -2.5,-5; 0,-5; 5,0
DR127 = smd 3.85 x 5.5: 1 -4.975,0; 2 4.975,0
TACTILE_SWITCH_PTH_6.0MM = drill 1.016 pad 1.88: 1 -3.251,2.261; 2 3.251,2.261; 3 -3.251,-2.261; 4 3.251,-2.261
LED3MM = drill 0.813 octagon: A -1.27,0; K 1.27,0
MSTBA2 = drill 1.397 long: 1 -2.54,5.08; 2 2.54,5.08
D-PAK_TO252AA = smd 1 x 1.6: 1 -2.28,-4.8; 3 2.28,-4.8 | smd 5.4 x 6.2: 4 0,2.5
0603@1 = smd 1.1 x 1: 1 -0.85,0; 2 0.85,0
R0805 = smd 1.3 x 1.5: 1 -0.95,0; 2 0.95,0
R1206 = smd 1.6 x 1.803: 1 -1.422,0; 2 1.422,0
R0603 = smd 0.889 x 0.889: 1 -0.762,0; 2 0.762,0
R0603' = smd 1 x 1.1: 1 -0.85,0; 2 0.85,0
TF-PULL = smd 0.7 x 1.4: 1 -2.2,-7.62; 2 -1.1,-7.62; 3 0,-7.62; 4 1.1,-7.62; 5 2.2,-7.62; 6 3.3,-7.62; 7 4.4,-7.62; 8 5.5,-7.62; 9 6.6,-7.62 | smd 1.4 x 2: S1 -7.9,2.85; S2 7.9,2.85 | smd 1.28 x 1.4: S3 7.96,-6.75 | smd 1.95 x 1.4: S4 -7.025,-6.75 | hole 1.25: -3.1,3.25; 4.9,3.25
XCVR_ESP32S3WROOM1N8R8 = smd 1.5 x 0.9: 1 -8.75,5.26; 2 -8.75,3.99; 3 -8.75,2.72; 4 -8.75,1.45; 5 -8.75,0.18; 6 -8.75,-1.09; 7 -8.75,-2.36; 8 -8.75,-3.63; 9 -8.75,-4.9; 10 -8.75,-6.17; 11 -8.75,-7.44; 12 -8.75,-8.71; 13 -8.75,-9.98; 14 -8.75,-11.25; 27 8.75,-11.25; 28 8.75,-9.98; 29 8.75,-8.71; 30 8.75,-7.44; 31 8.75,-6.17; 32 8.75,-4.9; 33 8.75,-3.63; 34 8.75,-2.36; 35 8.75,-1.09; 36 8.75,0.18; 37 8.75,1.45; 38 8.75,2.72; 39 8.75,3.99; 40 8.75,5.26 | smd 0.9 x 1.5: 15 -6.985,-12.5; 16 -5.715,-12.5; 17 -4.445,-12.5; 18 -3.175,-12.5; 19 -1.905,-12.5; 20 -0.635,-12.5; 21 0.635,-12.5; 22 1.905,-12.5; 23 3.175,-12.5; 24 4.445,-12.5; 25 5.715,-12.5; 26 6.985,-12.5 | smd 0.9 x 0.9: 41_1 -1.5,-2.46; 41_2 -2.9,-2.46; 41_3 -0.1,-2.46; 41_4 -2.9,-3.86; 41_5 -1.5,-3.86; 41_6 -0.1,-3.86; 41_7 -2.9,-1.06; 41_8 -1.5,-1.06; 41_9 -0.1,-1.06

### Placement (x,y rotation side)
C1  92.1,14 0 top
C2  92.1,16.7 0 top
C3  30.5,39.4 270 top
C4  78.6,31 90 top
C5  78.6,38.5 90 top
C6  78.6,23.5 90 top
C7  90.6,31 90 top
C8  96.1,28.5 90 top
C9  10.2,39.6 270 top
C10  81.6,23.5 90 top
C11  84.6,23.5 90 top
C12  24.5,38.4 337.5 top
C13  90.6,38.5 270 top
C14  53.2,32.1 180 top
C15  37.5,40.4 90 top
C16  10uF  [C1206']  7.9,38 90 top
C17  34,39.4 90 top
C18  52.8,10.9 180 top
C19  10uF  [C1206']  40.5,38.9 90 top
C20  53.2,34.1 0 top
C21  57.7,10.9 180 top
C23  6,16.4 90 top
C24  36,24.9 90 top
C25  96.1,37.5 90 top
C42  54,39.3 270 top
CON3  54.98,6.07 0 top
CON7  5,0 180 top
CON8  95,0 180 top
D7  17,15.4 270 top
D13  42,23.6 270 top
D14  35.6,32.4 180 top
D15  4,38 90 top
D16  24,15.4 90 top
D39  20.5,15.4 270 top
DEMP  95.5,19.8 180 top
IC1  84.6,31 0 top
IC4  9.5,27.9 90 top
IC5  15.5,38.9 270 top
J1  81.5,50.9 270 top
J2  83.4,4.7 90 top
J4  60.5,50.9 270 top
J5  39.5,50.9 270 top
J6  18.5,50.9 270 top
L5  24.5,26.9 90 top
LAT  95.5,22.5 180 top
MODE  46,4.6 270 top
PWR  12.8,15.4 270 top
PWRIN  16.4,3.4 0 top
Q5  31.5,15.4 90 top
R1  57.7,8.4 180 top
R2  52.7,8.4 0 top
R3  81.6,38.5 270 top
R4  87.6,38.5 270 top
R5  84.6,38.5 270 top
R6  90.6,23.5 270 top
R7  87.6,23.5 270 top
R8  81.5,16.9 270 top
R9  84,16.9 270 top
R10  79,16.9 270 top
R11  86.5,16.9 270 top
R12  12.9,12.2 180 top
R16  53.1,28.7 0 top
R24  51.8,40.1 90 top
R62  10R  [R0603']  42.9,18.8 180 top
R63  100K  [R0603']  39.5,18.8 180 top
RESET  39,4.6 270 top
SD1  68.7,6 180 top
SWOUT  28.9,3.4 0 top
U3  66.01,29.11 0 top

### Tracks (layer width: path | path; a pad name or v marks a point on that pad's centre or on a via)
3V3  (via drill 0.35, 0.45)
  Top 0.254: R24.1 51.8,39.15 51.05,38.4 50.5,38.4 | R16.1 52.25,28.75 53.05,29.55 53.2,29.7 53.2,32.7 53.96,33.46 C20.2 | C15.1 37.5,38.2 37.05,37.75 C17.1 | DEMP.3 v92.8,19.8 | v87.7,13.14 87.7,14 88,14.3 88,17 87.34,17.66 R11.1 R9.1 R8.1 R10.1
  Top 0.305: LAT.3 v92.7,22.5
  Top 0.406: 81.6,31 81.67,30.92 IC1.1 81.67,27.27 80.9,26.5 80.2,26.5 C6.2 | IC1.8 86.22,28.77 84.6,30.4 v84.6,31 | IC1.20 81.67,33.88 80.2,32.4
  Top 0.508: C20.2 55.2,34.1
  Top 0.813: C7.2 v88.9,32.4 | v84.6,31 81.6,31 80.2,32.4 C4.2 | 67.6,11.9 SD1.4
  Top 1.016: C4.2 78.6,34 77,35.6 61.2,35.6 58.7,33.1 U3.2 55.7,33.1 | C7.2 92.8,32.4 | 93.7,37.3 93.7,33.3 92.8,32.4 | 93.7,37.3 93.7,38.3 95.3,39.9 C25.+ | C13.2 93.5,37.1 93.7,37.3 | C8.+ 94.3,30.9 92.8,32.4 | 55.2,33.6 55.2,34.1
  Top 1.27: C8.+ 98.7,28.3 v98.7,21.2 | v67.6,11 67.6,11.9 | 55.7,33.1 55.2,33.6 | 55.2,34.1 55.2,34.8 54,36 C42.2 51,37.9 50.5,38.4 50.2,38.7 42.6,38.7 41.15,37.25 C19.1
  Top 1.5: C25.+ 86.58,49.42 J1.2 88.73,49.63 89.5,50.4 89.5,54.9 68,54.9 | 68,54.9 47,54.9 | 47,54.9 26.5,54.9 26,54.4 26,50.9 24.73,49.63 J6.2 | 47,54.9 47,50.4 46.23,49.63 J5.2 | 68,54.9 68,50.4 67.23,49.63 J4.2 | v28.5,47.4 26.5,45.4 19.5,45.4 18.5,44.4 18.5,39.05 IC5.4
  Bottom 0.305: v92.7,22.5 92.7,21.2 92.7,19.9 v92.8,19.8
  Bottom 0.813: v88.9,32.4 87.9,31.4 85.8,31.4 85.4,31 v84.6,31 | 92.7,21.2 v98.7,21.2
  Bottom 1.27: v98.7,21.2 98.7,14.8 97.04,13.14 v87.7,13.14 87.03,13.14 86.36,12.47 69.07,12.47 v67.6,11
  Bottom 1.5: v28.5,47.4 25.81,47.4 J6.2
  pour Top (isolate 0.254, no thermals): 16.3,38 17.9,36.4 41.7,36.4 41.7,38.9 24.8,38.9 23.7,37.8 21.5,37.8 20.1,39.2 20.1,40.7 19.5,41.3 17.4,41.3 16.3,40.2
5V
  Top 0.254: PWR.A 12.37,17.1 1.1,17.1 0.9,17.3 0.9,35.6 1.4,36.1 3.7,36.1 D15.C | C9.2 10.3,38.74 10.3,36.8 9.85,36.35 C16.1
  Top 1.5: IC5.3 13.7,36.6 15,37.9 15,45.9 16.5,47.4 21,47.4 | J6.4 21,49.59 21,47.4 | J1.4 84.04,47.94 83,46.9 63.5,46.9 | 63.5,46.9 42,46.9 | J5.4 42.04,46.94 42,46.9 | J4.4 63.04,47.36 63.5,46.9 | 21,47.4 25.5,47.4 27.5,49.4 29.5,49.4 32,46.9 42,46.9
  pour Top (isolate 0.254, rank 2, no thermals): 43.4,24.3 38.5,24.3 38.5,29.9 38,30.4 36.4,30.4 35.7,31.1 35.7,33.8 35.5,34 2.4,34 1.9,34.5 1.9,37.5 2.3,37.9 10.6,37.9 10.8,37.7 16.1,37.7 17.8,36 41.7,36 41.7,29.2 43.4,27.5
5V-REG
  pour Top (isolate 0.254, no thermals): 14,30.3 16.9,30.3 17.6,31 17.6,33.1 18.1,33.6 35.3,33.6 35.3,30.9 36.3,29.9 37.8,29.9 38,29.7 38,24.3 27.7,24.3 23.7,28.3 17.5,28.3 16.8,29 14,29
+24V
  pour Top (isolate 0.254, rank 2, no thermals): 12.8,25.1 17.2,25.1 18.4,23.9 18.4,16.5 18.2,16.3 14.6,16.3 13.3,17.6 1.4,17.6 1.4,21.9 12.4,21.9 12.7,22.2 12.7,25
BCK  (via drill 0.35)
  Top 0.254: U3.33 76.28,25.48 v76.4,25.6 | v87.6,40.7 R4.1
  Bottom 0.254: v76.4,25.6 77.5,25.6 78.24,26.34 78.54,26.34 79.26,27.06 79.26,31.22 81.59,33.54 81.59,39.09 82.8,40.29 83.91,40.29 84.2,40 85.1,40 85.8,40.7 v87.6,40.7
CC1
  Top 0.254: CON3.A5 53.73,8.22 R2.2
CC2
  Top 0.254: CON3.B5 56.73,8.32 R1.2
DATA  (via drill 0.35)
  Top 0.254: U3.34 77.05,26.75 v77.3,26.5 | v84.6,40.7 R5.1
  Bottom 0.254: v77.3,26.5 77.54,26.74 78.37,26.74 78.86,27.23 78.86,31.39 81.18,33.71 81.18,39.25 82.63,40.7 v84.6,40.7
GND  (via drill 0.35, 0.45)  (150 unrouted)
  Top 0.254: C20.1 C14.2 52.44,31.1 52,30.66 v52,30.3
  Top 0.406: IC1.3 82.97,29.17 v83.4,29.6 | IC1.9 86.88,29.07 v87.2,29.4 | IC1.19 82.33,32.52 v82,32.2 | IC1.16 84.28,32.92 v84.9,32.3 | IC1.12 86.88,34.97 v86.91,35 | v92.3,40.4 91.8,39.9 C13.1
  Top 0.813: v59.6,31.7 59.6,32.23 61.8,34.43 74.69,34.43 U3.40
  Top 1.016: v58.8,35.1 58.07,34.37 U3.1 56.9,34.73 56.9,35.2 55.6,36.5 55.6,39.8 54.7,40.7 C42.1
  Bottom 1.016: v59.6,31.7 59.3,32 59.3,34.6 v58.8,35.1
  other vias: 88.9,30.7 86.2,30.1 89.1,27.9 80.4,27.8 91.1,34.9 80.5,30.1 77.1,22.3 19.6,14.3 20.6,14.3 21.6,14.3 37.3,19.1 36.3,19.1 35.3,19.1 13.3,27.9 13.3,31.3 9,27.9 9,29.9 9,25.9 9,23.9 9,31.9 11,31.9 11,29.9 11,27.9 11,25.9 11,23.9 7,23.9 5,23.9 3,23.9 3,25.9 3,27.9 3,29.9 3,31.9 7,31.9 5,31.9 5,29.9 5,27.9 5,25.9 7,25.9 7,27.9 7,29.9 37.4,22.2 34.6,22.2 6,41 6,39.9 2.1,41 2.1,39.9 36,16.4 36,15.3 23.2,40.6 28.7,41 36,41 38.7,40.8 27.6,41 28.2,40.1 21.5,41.4 8.2,42.1 7.1,42.1 6,42.1 67.4,25.2 67.4,26.6 67.4,28 59.4,7 50.7,7 52,13 58.7,13.2 62.1,11.6 60.7,1.4 76.7,1.5 75.4,11.1 97,16.5 94,25.7 98.6,34.9 4.4,13.5 7.5,13.4 9.4,13 2.5,13 59.3,19.2 55.1,17.6 53,49 56.6,45.4 56.7,16 42.6,40.6
HSPI_CS  (via drill 0.35)
  Top 0.254: U3.18 62.84,18.46 63.23,18.86 64.87,18.86 65.2,18.53 v65.2,18.1 | R10.2 v79,14.9 | v69.8,15 SD1.2
  Bottom 0.254: v65.2,18.1 65.2,17.3 65.59,16.91 67.47,16.91 68.67,15.7 69.3,15.7 69.8,15.2 v69.8,15 70.2,14.6 78.7,14.6 v79,14.9
HSPI_MISO  (via drill 0.35)
  Top 0.254: R11.2 v86.5,14.9 | SD1.7 v64.3,15 65,15 65.38,15.38 U3.20
  Bottom 0.254: v86.5,14.9 84.98,13.38 65.92,13.38 v64.3,15
HSPI_MOSI  (via drill 0.35)
  Top 0.254: v64.1,18.1 v64.11,18.09 U3.19 | R8.2 v81.5,14.9 | v68.7,15 SD1.3
  Bottom 0.254: v64.1,18.1 64.1,17.8 65.4,16.5 67.3,16.5 68.7,15.1 v68.7,15 69.51,14.19 80.79,14.19 v81.5,14.9
HSPI_SCK  (via drill 0.35)
  Top 0.254: R9.2 v84,14.9 | SD1.5 v66.5,15 66.5,15.5 66.64,15.65 U3.21
  Bottom 0.254: v84,14.9 82.89,13.79 67.71,13.79 v66.5,15
IO0/BOOTMODE  (via drill 0.35)
  Top 0.254: v74.7,16.4 74.7,17.8 U3.27 | v68.2,20.4 70.72,20.4 72.08,21.76 v72.6,21.76 | 51.59,41.16 51.77,40.98 | 51.77,40.98 R24.2 | v50.5,40 51.48,40.98 51.77,40.98 | MODE.3 41.99,6.1 40.4,6.1 37.2,9.3 37.2,11.33 38.11,12.23 38.11,13.53 39.11,14.53 39.11,15.83 40.57,17.29 44.67,17.29 45.21,17.83 45.21,19.77 44.56,20.41 44.56,23.51 44.81,23.76 44.81,28.14 43.01,29.94 43.01,36.56 43.24,36.79 48.41,36.79 v48.9,36.3
  Bottom 0.254: v74.7,16.4 73.87,17.23 73.87,19.17 73.7,19.34 73.7,20.3 72.6,21.4 v72.6,21.76 | v68.2,20.4 67.11,19.31 61.47,19.31 59.39,21.39 57.4,21.39 55.87,22.92 55.87,26.1 54.39,27.58 54.39,28.71 53.52,29.58 53.52,31.98 51.12,34.38 51.12,37.3 50.82,37.6 | v50.5,40 51.12,39.38 51.12,37.9 50.82,37.6 | v48.9,36.3 48.9,36.4 50.1,37.6 50.82,37.6
IO1  (via drill 0.35)
  Top 0.254: v73.3,33.1 U3.39
  Bottom 0.254: v73.3,33.1 73.3,33.3 75.9,35.9 75.9,43.53 73.16,46.27 58.26,46.27 55.42,49.1 J4.10
IO2  (via drill 0.35)
  Top 0.254: v73.3,31.8 74.73,31.8 U3.38
  Bottom 0.254: v73.3,31.8 73.6,31.8 73.98,32.18 73.98,33.41 76.31,35.73 76.31,43.7 73.33,46.67 58.43,46.67 56.64,48.46 56.64,50.93 55.42,52.15 J4.9
IO3/TWI_SDA  (via drill 0.45)
  Top 0.254: v61.7,20.34 61.7,19.67 60.02,18 59.4,18 59.02,17.62 U3.15
  Bottom 0.254: v61.7,20.34 61.7,21.6 61.1,22.2 57.74,22.2 56.69,23.25 56.69,27.57 54.34,29.92 54.34,32.32 51.94,34.72 51.94,42.17 49.9,44.21 19.42,44.21 14.7,48.92 14.7,50.89 J6.9
IO4/TWI_SCK  (via drill 0.35, 0.45)
  Top 0.254: U3.4 56.26,30.56 55.8,30.1 55.8,28.2 v55.3,27.7
  Bottom 0.254: v60.7,21.2 60.15,21.2 59.55,21.79 57.57,21.79 56.28,23.08 56.28,26.72 v55.3,27.7 54.8,28.2 54.8,28.88 53.93,29.75 53.93,32.15 51.53,34.55 51.53,42 49.73,43.8 19.25,43.8 J6.10
IO5_LCD_RS  (via drill 0.45)
  Top 0.254: v60.4,30.3 59.39,29.29 U3.5
  Bottom 0.254: v60.4,30.3 59.7,30.3 58.4,31.6 58.4,34 56,36.4 56,43.85 51.58,48.27 41.43,48.27 40.8,48.91 40.8,50.87 J5.5
IO6_LCD_E  (via drill 0.45)
  Top 0.254: v60.9,29.1 60.6,28.8 59.9,28.8 59.4,28.3 59.4,27.77 59.02,27.4 58.41,27.4 57.78,28.02 U3.6
  Bottom 0.254: v60.9,29.1 60.33,29.1 57.99,31.43 57.99,33.83 55.59,36.23 55.59,43.68 51.41,47.86 41.27,47.86 J5.6
IO7_LCD_D4  (via drill 0.45)
  Top 0.254: v60.3,27.9 60.1,27.9 59.15,26.95 57.46,26.95 U3.7
  Bottom 0.254: v60.3,27.9 59.94,28.26 59.94,28.91 57.59,31.26 57.59,33.66 55.19,36.06 55.19,43.52 51.24,47.46 39.72,47.46 38.28,48.89 38.28,50.85 J5.7
IO8_PLAY  (via drill 0.45)
  Top 0.254: U3.12 58.3,20.4 59.9,22 61.9,22 62,22.1 62,22.6 62.4,23 v62.4,23.4
  Bottom 0.254: v62.4,23.4 62.38,23.42 58.24,23.42 57.9,23.76 57.9,28.07 55.55,30.42 55.55,32.82 53.16,35.22 53.16,42.67 50.4,45.43 21.62,45.43 18.5,48.55 J6.6
IO9_STOP  (via drill 0.45)
  Top 0.254: U3.17 61.56,18.39 63.01,19.83 63.01,20.71 v63.4,21.1
  Bottom 0.254: v63.4,21.1 62.41,21.1 62.11,21.4 62.11,21.77 61.27,22.61 57.91,22.61 57.09,23.42 57.09,27.74 54.74,30.08 54.74,32.48 52.34,34.88 52.34,42.34 50.07,44.61 20.49,44.61 15.96,49.14 J6.8
IO14_NEXT  (via drill 0.35)
  Top 0.254: v68,18 67.92,17.91 U3.22
  Bottom 0.254: v68,18 68.2,18 69.05,18.85 69.05,23.42 75.2,29.57 75.2,32.9 77.53,35.23 77.53,44.2 73.83,47.89 62.23,47.89 61.31,48.81 61.31,48.82 J4.6
IO15_LCD_D5  (via drill 0.45)
  Top 0.254: U3.8 57.68,25.48 58.7,26.5 59.9,26.5 v60,26.6
  Bottom 0.254: v60,26.6 59.53,27.07 59.53,28.75 57.18,31.09 57.18,33.49 54.78,35.89 54.78,43.35 51.08,47.05 39.55,47.05 J5.8
IO16_LCD_D6  (via drill 0.45)
  Top 0.254: U3.9 57.71,24.21 58.3,24.8 58.3,25.53 58.84,26.06 59.44,26.06 v60.1,25.4
  Bottom 0.254: v60.1,25.4 59.52,25.4 59.12,25.8 59.12,28.58 56.77,30.93 56.77,33.33 54.37,35.73 54.37,43.18 50.91,46.64 37.98,46.64 35.7,48.92 35.7,50.89 J5.9
IO17_LCD_D7  (via drill 0.45)
  Top 0.254: v59.2,24.6 59.2,23.7 58.44,22.94 U3.10
  Bottom 0.254: v59.2,24.6 58.72,25.08 58.72,28.41 56.37,30.76 56.37,33.16 53.97,35.56 53.97,43.01 50.74,46.24 37.81,46.24 J5.10
IO18_PREV  (via drill 0.45)
  Top 0.254: v60.3,24.2 60.3,22.97 58.99,21.67 U3.11
  Bottom 0.254: v60.3,24.2 59.93,23.83 58.41,23.83 58.31,23.93 58.31,28.24 55.96,30.59 55.96,32.99 53.56,35.39 53.56,42.84 50.57,45.83 21.79,45.83 19.72,47.9 19.72,50.95 J6.5
IO21_SHUFFLE  (via drill 0.35)
  Top 0.254: v69.26,17.94 69.19,17.87 U3.23
  Bottom 0.254: v69.26,17.94 69.45,18.14 69.45,23.25 75.61,29.4 75.61,32.73 77.93,35.06 77.93,44.37 74,48.3 62.4,48.3 61.72,48.98 61.72,50.93 60.5,52.15 J4.5
IO35  (via drill 0.35)
  Top 0.254: U3.28 74.06,19.13 v73.13,18.2 v73.11,18.2
  Bottom 0.254: v73.11,18.2 72.52,18.8 72.3,18.8 71.08,20.02 71.08,22.57 77.23,28.72 77.23,32.06 79.56,34.38 79.56,48.06 80.2,48.7 80.2,50.93 J1.7
IO36  (via drill 0.35)
  Top 0.254: v73,19.4 73,19.6 73.8,20.4 U3.29
  Bottom 0.254: v73,19.4 72.3,19.4 71.49,20.21 71.49,22.41 77.64,28.56 77.64,31.89 79.96,34.22 79.96,47.86 81.5,49.4 J1.6
IO37  (via drill 0.35)
  Top 0.254: U3.30 74.16,21.67 72.76,20.27 72.52,20.27 v72.39,20.4
  Bottom 0.254: v72.39,20.4 72.39,20.7 71.89,21.2 71.89,22.24 78.05,28.39 78.05,31.72 80.37,34.05 80.37,47.7 80.88,48.2 82.2,48.2 82.72,48.72 82.72,50.95 J1.5
IO38_MOSFET  (via drill 0.35)
  Top 0.254: U3.31 74.04,22.94 73.6,22.5 73.6,21.68 73.02,21.1 72,21.1 71.4,20.5 71.4,19.5 71.2,19.3 v68.3,19.3 | R62.1 43.75,23.85 44,24.1 44,27.8 42.2,29.6 42.2,36.9 42.9,37.6 49.4,37.6 50.21,36.79 v50.47,36.79
  Bottom 0.254: v68.3,19.3 67.7,19.3 67.3,18.9 61.3,18.9 59.22,20.98 57.23,20.98 55.47,22.75 55.47,25.93 53.99,27.41 53.99,28.54 53.12,29.41 53.12,31.81 50.72,34.21 50.72,36.53 v50.47,36.79
IO45_LCD_BACKLIGHT  (via drill 0.35)
  Top 0.254: U3.26 73,17.13 v72.02,18.11 v72.01,18.11
  Bottom 0.254: v72.01,18.11 72.01,18.49 70.67,19.83 70.67,22.74 76.83,28.89 76.83,32.23 79.15,34.55 79.15,49.44 J1.8
IO46_PAUSE  (via drill 0.45)
  Top 0.254: U3.16 60.3,17.7 62.6,20 62.6,21.9 v62.9,22.2
  Bottom 0.254: v62.9,22.2 62.25,22.2 61.44,23.01 58.07,23.01 57.5,23.59 57.5,27.9 55.15,30.25 55.15,32.65 52.75,35.05 52.75,42.5 50.23,45.02 20.66,45.02 17.28,48.39 17.28,50.85 J6.7
IO47_VOLM  (via drill 0.35)
  Top 0.254: v70.25,17.95 70.45,17.75 U3.24
  Bottom 0.254: v70.25,17.95 70.2,18 70.2,18.71 69.86,19.05 69.86,23.08 76.01,29.23 76.01,32.56 78.34,34.89 78.34,47.74 76.44,49.63 J1.10
IO48_VOLP  (via drill 0.35)
  Top 0.254: v70.99,18.5 70.99,17.9 71.72,17.17 U3.25
  Bottom 0.254: v70.99,18.5 70.27,19.22 70.27,22.91 76.42,29.06 76.42,32.4 78.75,34.72 78.75,47.91 77.64,49.01 77.64,50.95 J1.9
L_DAC
  Top 0.508: R7.2 90.7,18.98 C2.1 89.3,15.3 89.3,12.5 88.4,11.6 82.8,11.6 J2.RSH J2.RING
LDOO
  Top 0.305: C5.1 80.3,35.4 82.6,35.4 82.97,35.02 IC1.18
LRCK  (via drill 0.35)
  Top 0.254: U3.35 77.48,28.02 v78.1,27.4 | v81.6,40.8 R3.1
  Bottom 0.254: v78.1,27.4 78.1,27.87 78.45,28.22 78.45,31.55 80.78,33.88 80.78,39.48 81.6,40.3 v81.6,40.8
MOSFET-GND
  pour Top (isolate 0.254, no thermals): 22.9,14.9 25.5,14.9 25.9,14.5 25.9,12.2 24.8,11.1 24.8,6.4 25.4,5.8 28.9,5.8 29.3,6.2 29.3,9.8 32.2,12.7 32.2,18.6 23.1,18.6 22.8,18.3 22.8,15
N$1
  Top 0.254: PWR.K 12.05,13.38 R12.2
N$2  (via drill 3.1)
  other vias: 95,80.8
N$3
  Top 0.254: R62.2 42.05,19.55 41.7,19.9 39,19.9 38.65,19.55 R63.2 38.65,16.65 38.2,16.2 38.2,15.02 Q5.1
N$4  (via drill 3.1)
  other vias: 5,80.8
N$10
  Top 0.305: IC1.13 86.22,35.7 R4.2
N$11
  Top 0.305: IC1.14 85.58,36.47 84.6,37.45 R5.2
N$12
  Top 0.305: IC1.11 87.53,30.38 88.1,29.8 88.1,27.31 88.4,27.01 89.8,27.01 90.06,26.76 91.7,26.76 91.79,26.76 92.36,26.19 92.36,24 92.66,23.7 95.2,23.7 95.5,23.4 LAT.2
N$13
  Top 0.305: IC1.10 87.53,27.03 88,26.56 89.61,26.56 89.87,26.3 91.6,26.3 91.9,26 91.9,22.1 92.8,21.2 95.3,21.2 95.5,21 DEMP.2
N$34
  Top 0.305: IC1.15 84.92,36.27 84.7,36.5 82.15,36.5 81.6,37.05 R3.2
N$43
  Top 0.305: IC1.4 83.62,27.12 82.9,26.4 82.9,23.3 81.7,22.1 C10.1
N$46
  Top 0.305: IC1.2 82.33,27.02 81.6,26.3 C10.2
N$47
  Top 0.305: IC1.5 84.28,27.13 83.36,26.21 83.36,23.34 C11.1
N$48
  Top 0.305: IC1.7 85.58,27.18 85.9,26.86 86.31,26.86 87.07,26.1 89.42,26.1 R6.1
N$49
  Top 0.305: IC1.6 84.92,26.77 85.3,26.4 86.12,26.4 R7.1
N$164
  pour Top (isolate 0.254, no thermals): 14.1,26.9 16.6,26.9 17.5,27.8 23.5,27.8 27.3,24 27.3,19.1 22.9,19.1 22.3,18.5 22.3,17.3 21.9,16.9 19.2,16.9 18.8,17.3 18.8,24.1 17.4,25.5 14.1,25.5
R-DAC
  Top 0.508: J2.TSH J2.TIP 88.4,10.3 90.7,12.6 C1.1 92.1,15.4 92.1,18.6 90.6,20.1 R6.2
RESET  (via drill 0.35)
  Top 0.254: U3.3 55.87,31.83 55.6,32.1 C14.1 53.96,31.38 53.68,31.1 53.68,30.02 53.95,29.75 R16.2 53.95,26.25 v54,26.2 | RESET.3 36.74,11.44 37.7,12.4 37.7,13.7 38.7,14.7 38.7,16 40.4,17.7 44.5,17.7 44.8,18 44.8,19.6 44.16,20.24 44.16,23.68 44.41,23.93 44.41,27.97 42.61,29.77 42.61,36.73 43.07,37.19 49.2,37.19 49.7,36.69 49.7,36.1 v50,35.8
  Bottom 0.254: v54,26.2 54,26.8 53.58,27.22 53.58,28.38 52.71,29.24 52.71,31.64 50.31,34.04 50.31,35.49 v50,35.8
RX  (via drill 0.35)
  Top 0.254: v73.3,29.3 U3.36
  Bottom 0.254: v73.3,29.3 74.36,29.3 74.79,29.73 74.79,33.07 77.12,35.39 77.12,44.03 73.66,47.49 60.51,47.49 59.2,48.8 59.2,50.93 J4.7
TX  (via drill 0.35)
  Top 0.254: v73.3,30.5 74.7,30.5 U3.37
  Bottom 0.254: v73.3,30.5 73.9,30.5 74.39,30.99 74.39,33.24 76.71,35.56 76.71,43.86 73.5,47.08 60.34,47.08 57.96,49.46 J4.8
USB_D_N
  Top 0.254: CON3.A7 55.23,5.3 arc-180 54.23,5.3 CON3.B7 54.23,7.33 55.3,8.4 55.3,16.5 56,17.2 56,18.3 56.83,19.13 U3.13
USB_D_P
  Top 0.254: CON3.B6 55.73,8.2 | CON3.A6 54.73,7.2 55.73,8.2 | 55.73,8.2 55.73,16.33 U3.14
VBUS  (via drill 0.35)
  Top 0.254: CON3.VBUS2 57.43,7.23 57.7,7.5 57.7,10.14 C21.2 | CON3.VBUS1 52.53,7.23 52.7,7.4 52.7,9.95 C18.1
  Top 0.406: CON3.VBUS1 52.53,5.27 v53.2,4.6 | CON3.VBUS2 57.43,5.33 v56.7,4.6
  Top 1.27: v39.4,21.7 39.6,21.5 41.92,21.5 D13.A
  Bottom 1.016: v56.7,4.6 56.7,3.9 55.7,2.9 | 53,2.9 53.2,3.1 v53.2,4.6 53.1,4.7
  Bottom 1.27: 55.7,2.9 53,2.9 50.1,2.9 49.8,3.2 36.3,3.2 34.6,4.9 34.6,9 39.4,13.8 v39.4,21.7
VIN
  pour Top (isolate 0.254, rank 2, no thermals): 32.3,12.2 29.7,9.6 29.7,6 29.1,5.4 25.2,5.4 24.4,6.2 24.4,11.3 25.5,12.4 25.5,14.3 25.3,14.5 22.9,14.5 22.2,13.8 22.2,12 22,11.8 19.1,11.8 18.9,12 18.9,14.2 18.7,14.4 15.7,14.4 15.7,0.4 34.7,0.4 34.7,12.2
XSMT  (via drill 0.35)
  Top 0.254: U3.32 76.21,24.21 v76.4,24.4 | IC1.17 83.62,32.52 v83.5,32.4
  Bottom 0.254: v76.4,24.4 77.19,25.19 77.67,25.19 78.4,25.93 78.71,25.93 79.67,26.89 79.67,31.05 81.66,33.04 82.86,33.04 v83.5,32.4

### Text on the board
tPlace: -PWRIN+ | -SWOUT+ | USB | SDCARD | LINEOUT | PORT A | PORT B | PORT C | PORT D | 3/SDA | 46 | 18 | GND | GND | 16 | 7 | 5 | GND | GND | 2 | RX | 21 | GND | GND | 48 | 35 | 37 | GND | GND | 4/SCL | 9 | 8 | 5V | 3V3 | 17 | 15 | 6 | 5V | 3V3 | 1 | TX | 14 | 5V | 3V3 | 47 | 45 | 36 | 5V | 3V3 | KAROO / ELECTRONICS | DIGITAL / AUDIO / CORE | + | (C) 2024 | V1.0BETA
bPlace: AUDIO DEVBOARD 1.0BETA / MCU: ESP32S3 / DAC: PCM5102A / I2S MUTE: 39 / I2S BCK: 40 / I2S DATA: 41 / I2S LRCK: 45 / SD CS: 10 / SD MOSI: 11 / SD MISO: 12 / SD SCK: 13 / MOSFET: 38 | L | R | GND | V+ | GND